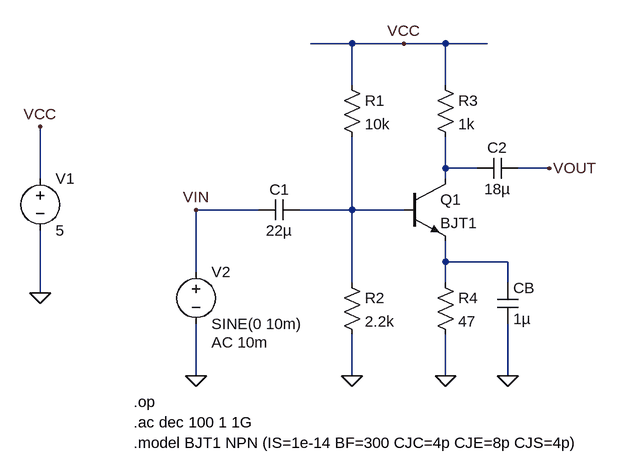
[diagram p0: schematic common_emitter_AC.asc]
common_emitter_AC.asc, the LTspice schematic file:
Version 4
SHEET 1 880 680
WIRE 32 -112 -32 -112
WIRE 112 -112 32 -112
WIRE 176 -112 112 -112
WIRE 240 -112 176 -112
WIRE 32 -48 32 -112
WIRE 176 -48 176 -112
WIRE 176 80 176 32
WIRE 224 80 176 80
WIRE 336 80 288 80
WIRE -448 96 -448 16
WIRE 176 96 176 80
WIRE -112 144 -208 144
WIRE 32 144 32 32
WIRE 32 144 -48 144
WIRE 112 144 32 144
WIRE 176 224 176 192
WIRE 272 224 176 224
WIRE -208 240 -208 144
WIRE 32 256 32 144
WIRE 176 256 176 224
WIRE 272 256 272 224
WIRE -448 272 -448 176
WIRE -208 400 -208 320
WIRE 32 400 32 336
WIRE 176 400 176 336
WIRE 272 400 272 320
FLAG 176 400 0
FLAG 272 400 0
FLAG 32 400 0
FLAG 112 -112 VCC
FLAG -208 144 VIN
FLAG 336 80 VOUT
FLAG -448 272 0
FLAG -448 16 VCC
FLAG -208 400 0
SYMBOL res 16 -64 R0
SYMATTR InstName R1
SYMATTR Value 10k
SYMBOL res 16 240 R0
SYMATTR InstName R2
SYMATTR Value 2.2k
SYMBOL res 160 -64 R0
SYMATTR InstName R3
SYMATTR Value 1k
SYMBOL res 160 240 R0
SYMATTR InstName R4
SYMATTR Value 47
SYMBOL cap -48 128 R90
WINDOW 0 0 32 VBottom 2
WINDOW 3 32 32 VTop 2
SYMATTR InstName C1
SYMATTR Value 22µ
SYMBOL cap 256 256 R0
SYMATTR InstName CB
SYMATTR Value 1µ
SYMBOL npn 112 96 R0
SYMATTR InstName Q1
SYMATTR Value BJT1
SYMBOL voltage -448 80 R0
WINDOW 123 0 0 Left 0
WINDOW 39 0 0 Left 0
SYMATTR InstName V1
SYMATTR Value 5
SYMBOL voltage -208 224 R0
WINDOW 123 24 124 Left 2
WINDOW 39 0 0 Left 0
SYMATTR Value2 AC 10m
SYMATTR InstName V2
SYMATTR Value SINE(0 10m)
SYMBOL cap 288 64 R90
WINDOW 0 0 32 VBottom 2
WINDOW 3 32 32 VTop 2
SYMATTR InstName C2
SYMATTR Value 18µ
TEXT -304 440 Left 2 !.op\n.ac dec 100 1 1G\n.model BJT1 NPN (IS=1e-14 BF=300 CJC=4p CJE=8p CJS=4p)

The netlist it stands for:
* common_emitter_AC.asc
R1 VCC N002 10k
R2 N002 0 2.2k
R3 VCC N001 1k
R4 N003 0 47
C1 N002 VIN 22µ
CB N003 0 1µ
Q1 N001 N002 N003 0 BJT1
V1 VCC 0 5
V2 VIN 0 SINE(0 10m) AC 10m
C2 VOUT N001 18µ
.model NPN NPN
.model PNP PNP
.lib standard.bjt
.op
.ac dec 100 1 1G
.model BJT1 NPN (IS=1e-14 BF=300 CJC=4p CJE=8p CJS=4p)
.backanno
.end